# Altium schematic sheet P01_Title Page.SchDoc
size 386 x 246 mm
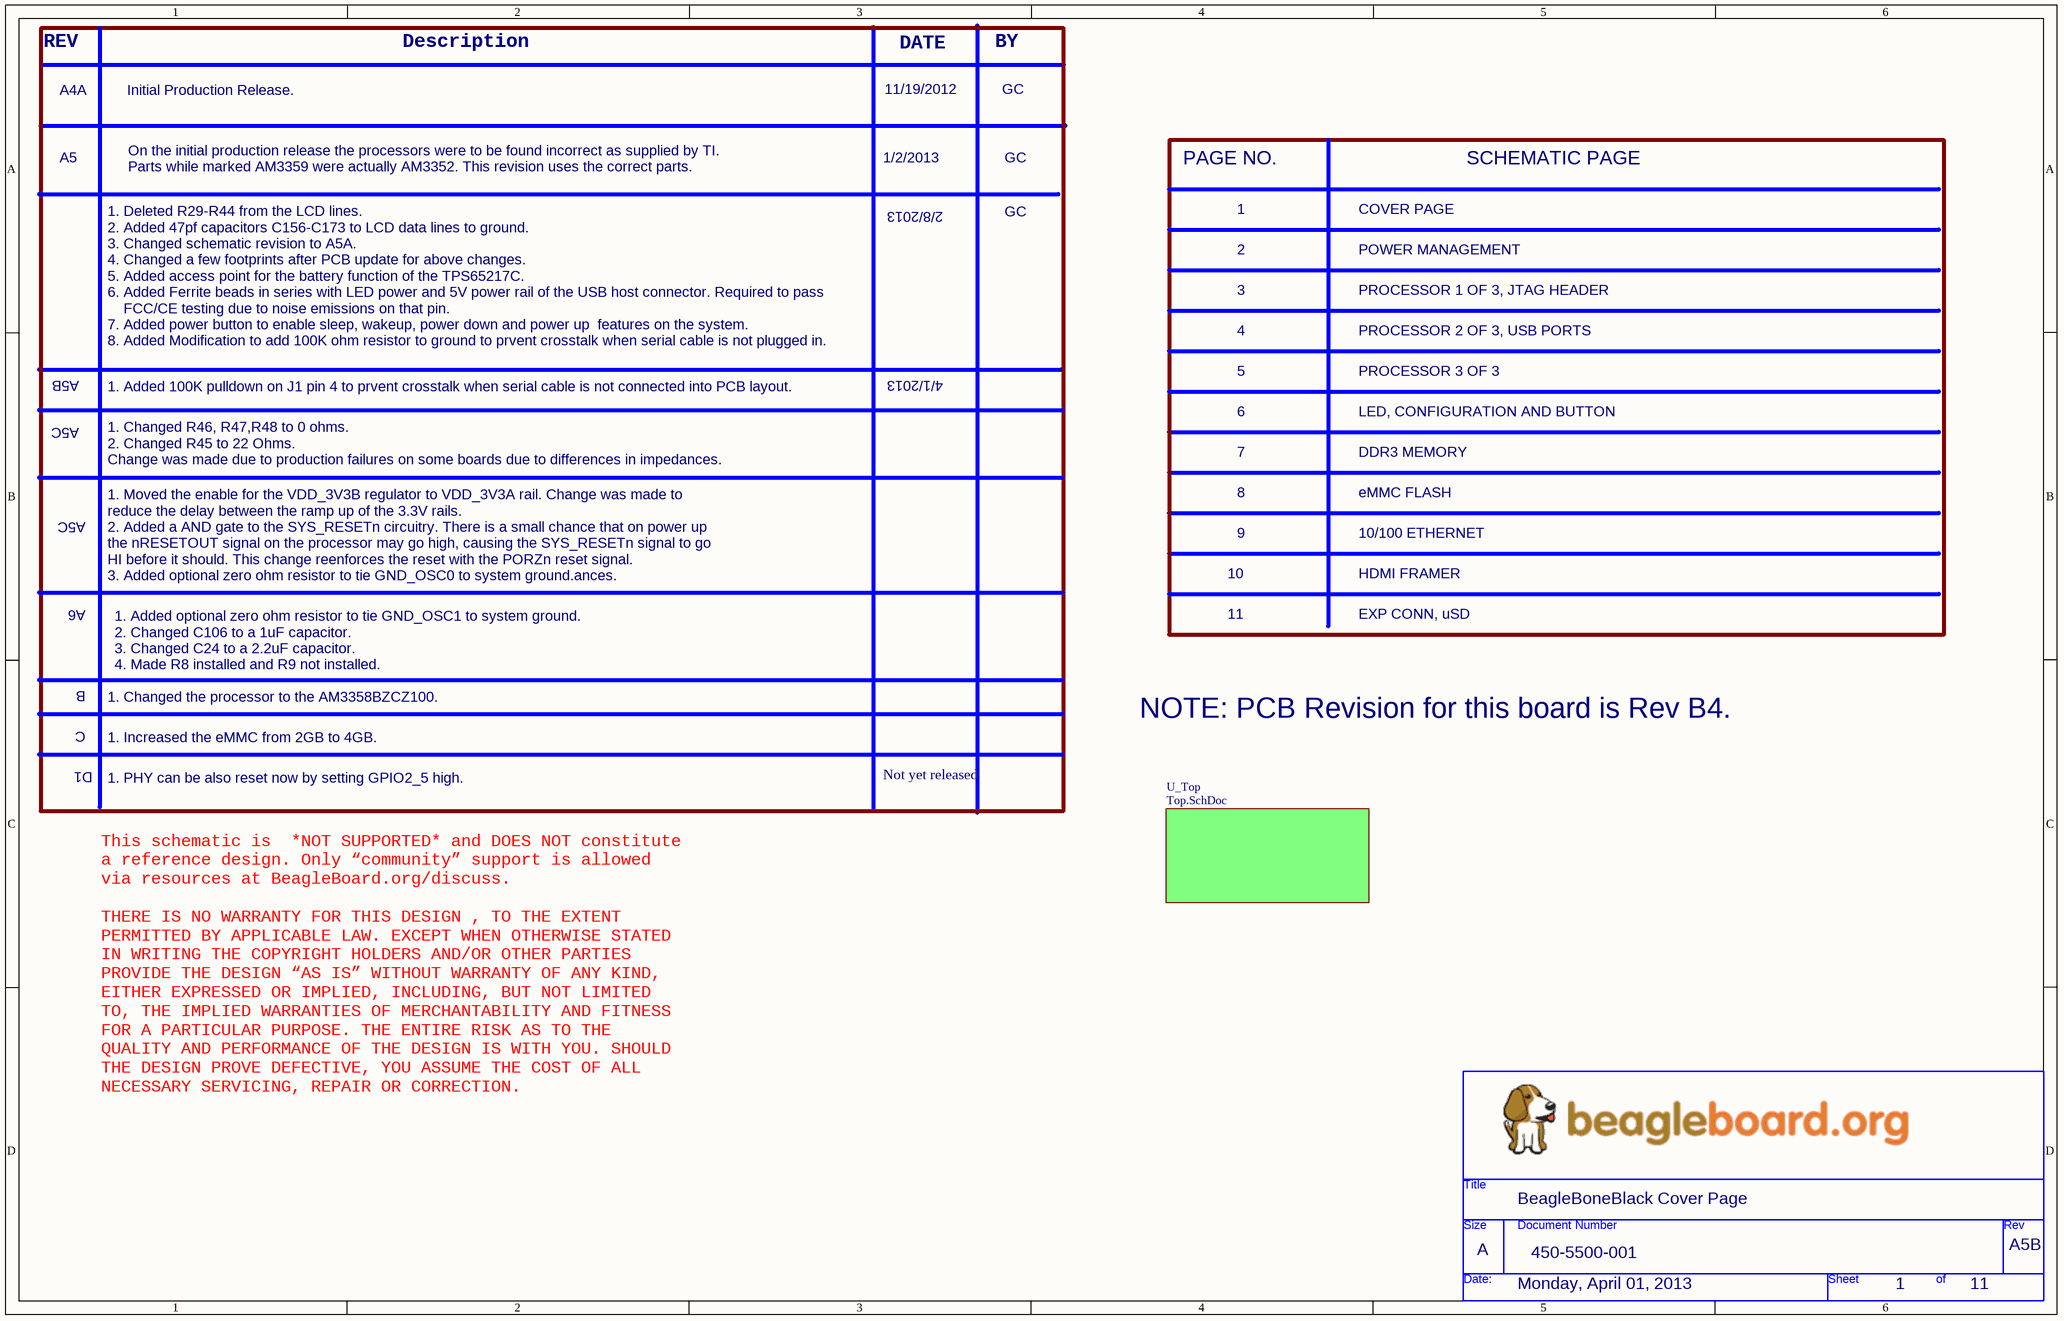
[diagram p0: P01_Title Page.SchDoc]

## Parts
*  Page Create Date: Monday, April 01, 2013  Doc: 450-5500-001  RevCode: A5B  Title: BeagleBoneBlack Cover Page  Page Size: A  Page Number: 1  Page Count: 11  (hidden comment: BeagleBoard_org)  (graphical)

## Sub-sheets
U_Top = Top.SchDoc: no entries

## Notes on the sheet
- REV
- Description
- DATE
- BY
- A4A
- Initial Production Release.
- 11/19/2012
- GC
- A5
- On the initial production release the processors were to be found incorrect as supplied by TI.
  Parts while marked AM3359 were actually AM3352. This revision uses the correct parts.
- 1/2/2013
- PAGE NO.
- SCHEMATIC PAGE
- 2/8/2013
- 1
- 2
- POWER MANAGEMENT
- COVER PAGE
- 3
- PROCESSOR 1 OF 3, JTAG HEADER
- A5B
- 4/1/2013
- 4
- 5
- PROCESSOR 2 OF 3, USB PORTS
- PROCESSOR 3 OF 3
- A5C
- 1. Deleted R29-R44 from the LCD lines.
  2. Added 47pf capacitors C156-C173 to LCD data lines to ground.
  3. Changed schematic revision to A5A.
  4. Changed a few footprints after PCB update for above changes.
  5. Added access point for the battery function of the TPS65217C.
  6. Added Ferrite beads in series with LED power and 5V power rail of the USB host connector. Required to pass
  FCC/CE testing due to noise emissions on that pin.
  7. Added power button to enable sleep, wakeup, power down and power up  features on the system.
  8. Added Modification to add 100K ohm resistor to ground to prvent crosstalk when serial cable is not plugged in.
- 7
- 6
- DDR3 MEMORY
- LED, CONFIGURATION AND BUTTON
- 1. Added 100K pulldown on J1 pin 4 to prvent crosstalk when serial cable is not connected into PCB layout.
- 1. Changed R46, R47,R48 to 0 ohms.
  2. Changed R45 to 22 Ohms.
  Change was made due to production failures on some boards due to differences in impedances.
- 8
- eMMC FLASH
- 1. Moved the enable for the VDD_3V3B regulator to VDD_3V3A rail. Change was made to
  reduce the delay between the ramp up of the 3.3V rails.
  2. Added a AND gate to the SYS_RESETn circuitry. There is a small chance that on power up
  the nRESETOUT signal on the processor may go high, causing the SYS_RESETn signal to go
  HI before it should. This change reenforces the reset with the PORZn reset signal.
  3. Added optional zero ohm resistor to tie GND_OSC0 to system ground.ances.
- 10
- 9
- HDMI FRAMER
- 10/100 ETHERNET
- A6
- 11
- EXP CONN, uSD
- B
- C
- 1. Changed the processor to the AM3358BZCZ100.
- 1. Added optional zero ohm resistor to tie GND_OSC1 to system ground.
  2. Changed C106 to a 1uF capacitor.
  3. Changed C24 to a 2.2uF capacitor.
  4. Made R8 installed and R9 not installed.
- NOTE: PCB Revision for this board is Rev B4.
- D1
- 1. Increased the eMMC from 2GB to 4GB.
- 1. PHY can be also reset now by setting GPIO2_5 high.
- Not yet released
- This schematic is  *NOT SUPPORTED* and DOES NOT constitute
  a reference design. Only “community” support is allowed
  via resources at BeagleBoard.org/discuss.
  THERE IS NO WARRANTY FOR THIS DESIGN , TO THE EXTENT
  PERMITTED BY APPLICABLE LAW. EXCEPT WHEN OTHERWISE STATED
  IN WRITING THE COPYRIGHT HOLDERS AND/OR OTHER PARTIES
  PROVIDE THE DESIGN “AS IS” WITHOUT WARRANTY OF ANY KIND,
  EITHER EXPRESSED OR IMPLIED, INCLUDING, BUT NOT LIMITED
  TO, THE IMPLIED WARRANTIES OF MERCHANTABILITY AND FITNESS
  FOR A PARTICULAR PURPOSE. THE ENTIRE RISK AS TO THE
  QUALITY AND PERFORMANCE OF THE DESIGN IS WITH YOU. SHOULD
  THE DESIGN PROVE DEFECTIVE, YOU ASSUME THE COST OF ALL
  NECESSARY SERVICING, REPAIR OR CORRECTION.
- (in symbol BeagleBoard_org) Title; Size; Document Number; Rev; Date:; Sheet; of